# Altium schematic sheet High Freq.SchDoc
size A4; SheetNumber: 5; SheetTotal: 5
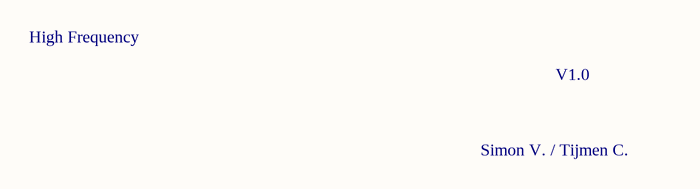
[diagram p0: High Freq.SchDoc]

## Notes on the sheet
- High Frequency
- V1.0
- Simon V. / Tijmen C.